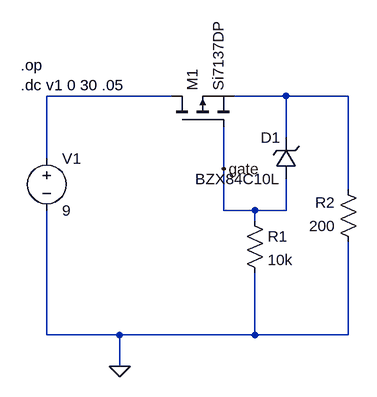
[diagram p0: schematic normal_voltage.asc]
normal_voltage.asc, the LTspice schematic file:
Version 4
SHEET 1 880 680
WIRE 224 112 32 112
WIRE 400 112 320 112
WIRE 496 112 400 112
WIRE 400 176 400 112
WIRE 32 208 32 112
WIRE 304 224 304 160
WIRE 496 256 496 112
WIRE 304 288 304 224
WIRE 352 288 304 288
WIRE 400 288 400 240
WIRE 400 288 352 288
WIRE 352 304 352 288
WIRE 32 480 32 288
WIRE 144 480 32 480
WIRE 352 480 352 384
WIRE 352 480 144 480
WIRE 496 480 496 336
WIRE 496 480 352 480
WIRE 144 528 144 480
FLAG 304 224 gate
FLAG 144 528 0
SYMBOL pmos 224 160 R270
SYMATTR InstName M1
SYMATTR Value Si7137DP
SYMBOL voltage 32 192 R0
SYMATTR InstName V1
SYMATTR Value 9
SYMATTR SpiceLine Rser=.01
SYMBOL res 512 352 R180
WINDOW 0 36 76 Left 2
WINDOW 3 36 40 Left 2
SYMATTR InstName R2
SYMATTR Value 200
SYMBOL res 336 288 R0
SYMATTR InstName R1
SYMATTR Value 10k
SYMBOL zener 416 240 R180
WINDOW 0 24 64 Left 2
WINDOW 3 24 0 Left 2
SYMATTR InstName D1
SYMATTR Value BZX84C10L
TEXT -8 64 Left 2 !.op\n.dc v1 0 30 .05

The netlist it stands for:
* normal_voltage.asc
M1 N001 gate N002 N002 Si7137DP
V1 N001 0 9 Rser=.01
R2 0 N002 200
R1 gate 0 10k
D1 gate N002 BZX84C10L
.model D D
.lib standard.dio
.model NMOS NMOS
.model PMOS PMOS
.lib standard.mos
.op
.dc v1 0 30 .05
.backanno
.end